# Altium schematic sheet CPLD.SchDoc
size A4
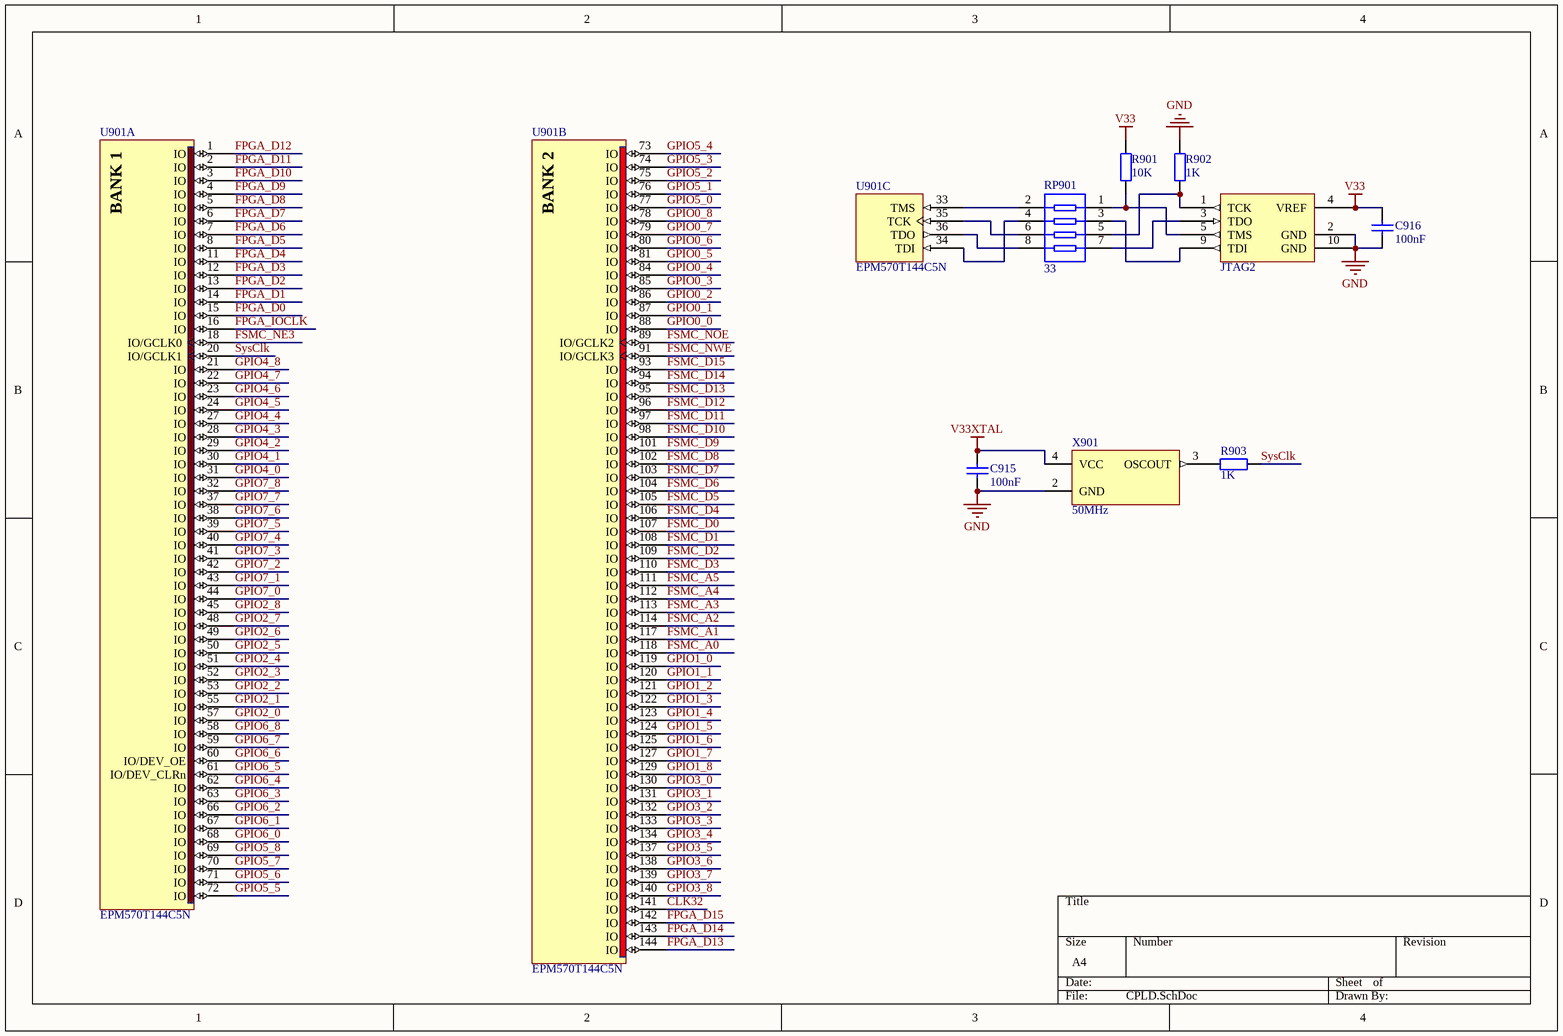
[diagram p0: CPLD.SchDoc]

## Parts
C915  value 100nF  [0603C]  (hidden comment: MLCC)
C916  value 100nF  [0805C]  (hidden comment: MLCC)
JTAG2  JTAG_ALTERA  [JTAG10]  (value not drawn)
R901  value 10K  [0603R]  (hidden comment: Resistor)
R902  value 1K  [0603R]  (hidden comment: Resistor)
R903  value 1K  [0603R]  (hidden comment: Resistor)
RP901  value 33  [8P4R_0603]  (hidden comment: Res Pack)
U901  EPM570T144C5N  [TQFP144_N]  (parts A,B,C of 5)
X901  value 50MHz  [XTAL-7050]  (hidden comment: Oscillator)

## Nets
GND: C915.1 C916.1 JTAG2.2(GND) JTAG2.10(GND) R902.2 X901.2(GND)
V33: C916.2 JTAG2.4(VREF) R901.2
V33XTAL: C915.2 X901.4(VCC)
CLK32: U901.141(IO)
FPGA_D0: U901.15(IO)
FPGA_D1: U901.14(IO)
FPGA_D2: U901.13(IO)
FPGA_D3: U901.12(IO)
FPGA_D4: U901.11(IO)
FPGA_D5: U901.8(IO)
FPGA_D6: U901.7(IO)
FPGA_D7: U901.6(IO)
FPGA_D8: U901.5(IO)
FPGA_D9: U901.4(IO)
FPGA_D10: U901.3(IO)
FPGA_D11: U901.2(IO)
FPGA_D12: U901.1(IO)
FPGA_D13: U901.144(IO)
FPGA_D14: U901.143(IO)
FPGA_D15: U901.142(IO)
FPGA_IOCLK: U901.16(IO)
FSMC_A0: U901.118(IO)
FSMC_A1: U901.117(IO)
FSMC_A2: U901.114(IO)
FSMC_A3: U901.113(IO)
FSMC_A4: U901.112(IO)
FSMC_A5: U901.111(IO)
FSMC_D0: U901.107(IO)
FSMC_D1: U901.108(IO)
FSMC_D2: U901.109(IO)
FSMC_D3: U901.110(IO)
FSMC_D4: U901.106(IO)
FSMC_D5: U901.105(IO)
FSMC_D6: U901.104(IO)
FSMC_D7: U901.103(IO)
FSMC_D8: U901.102(IO)
FSMC_D9: U901.101(IO)
FSMC_D10: U901.98(IO)
FSMC_D11: U901.97(IO)
FSMC_D12: U901.96(IO)
FSMC_D13: U901.95(IO)
FSMC_D14: U901.94(IO)
FSMC_D15: U901.93(IO)
FSMC_NE3: U901.18(IO/GCLK0)
FSMC_NOE: U901.89(IO/GCLK2)
FSMC_NWE: U901.91(IO/GCLK3)
GPIO0_0: U901.88(IO)
GPIO0_1: U901.87(IO)
GPIO0_2: U901.86(IO)
GPIO0_3: U901.85(IO)
GPIO0_4: U901.84(IO)
GPIO0_5: U901.81(IO)
GPIO0_6: U901.80(IO)
GPIO0_7: U901.79(IO)
GPIO0_8: U901.78(IO)
GPIO1_0: U901.119(IO)
GPIO1_1: U901.120(IO)
GPIO1_2: U901.121(IO)
GPIO1_3: U901.122(IO)
GPIO1_4: U901.123(IO)
GPIO1_5: U901.124(IO)
GPIO1_6: U901.125(IO)
GPIO1_7: U901.127(IO)
GPIO1_8: U901.129(IO)
GPIO2_0: U901.57(IO)
GPIO2_1: U901.55(IO)
GPIO2_2: U901.53(IO)
GPIO2_3: U901.52(IO)
GPIO2_4: U901.51(IO)
GPIO2_5: U901.50(IO)
GPIO2_6: U901.49(IO)
GPIO2_7: U901.48(IO)
GPIO2_8: U901.45(IO)
GPIO3_0: U901.130(IO)
GPIO3_1: U901.131(IO)
GPIO3_2: U901.132(IO)
GPIO3_3: U901.133(IO)
GPIO3_4: U901.134(IO)
GPIO3_5: U901.137(IO)
GPIO3_6: U901.138(IO)
GPIO3_7: U901.139(IO)
GPIO3_8: U901.140(IO)
GPIO4_0: U901.31(IO)
GPIO4_1: U901.30(IO)
GPIO4_2: U901.29(IO)
GPIO4_3: U901.28(IO)
GPIO4_4: U901.27(IO)
GPIO4_5: U901.24(IO)
GPIO4_6: U901.23(IO)
GPIO4_7: U901.22(IO)
GPIO4_8: U901.21(IO)
GPIO5_0: U901.77(IO)
GPIO5_1: U901.76(IO)
GPIO5_2: U901.75(IO)
GPIO5_3: U901.74(IO)
GPIO5_4: U901.73(IO)
GPIO5_5: U901.72(IO)
GPIO5_6: U901.71(IO)
GPIO5_7: U901.70(IO)
GPIO5_8: U901.69(IO)
GPIO6_0: U901.68(IO)
GPIO6_1: U901.67(IO)
GPIO6_2: U901.66(IO)
GPIO6_3: U901.63(IO)
GPIO6_4: U901.62(IO)
GPIO6_5: U901.61(IO/DEV_CLRn)
GPIO6_6: U901.60(IO/DEV_OE)
GPIO6_7: U901.59(IO)
GPIO6_8: U901.58(IO)
GPIO7_0: U901.44(IO)
GPIO7_1: U901.43(IO)
GPIO7_2: U901.42(IO)
GPIO7_3: U901.41(IO)
GPIO7_4: U901.40(IO)
GPIO7_5: U901.39(IO)
GPIO7_6: U901.38(IO)
GPIO7_7: U901.37(IO)
GPIO7_8: U901.32(IO)
SysClk: R903.2 U901.20(IO/GCLK1)
NetJTAG2_1: JTAG2.1(TCK) R902.1 RP901.5
NetJTAG2_3: JTAG2.3(TDO) RP901.7
NetJTAG2_5: JTAG2.5(TMS) R901.1 RP901.1
NetJTAG2_9: JTAG2.9(TDI) RP901.3
NetR903_1: R903.1 X901.3(OSCOUT)
NetRP901_2: RP901.2 U901.33(TMS)
NetRP901_4: RP901.4 U901.34(TDI)
NetRP901_6: RP901.6 U901.35(TCK)
NetRP901_8: RP901.8 U901.36(TDO)

## Notes on the sheet
- (in symbol EPM570T144C5N, part A) BANK 1
- (in symbol EPM570T144C5N, part B) BANK 2

## Library data of the parts
JTAG2 = JTAG_ALTERA: ALTERA JTAG port
RP901 = Res Pack: Isolated Resistor Network
U901 = EPM570T144C5N: MAX II 3.3/2.5V CPLD, 116 IOs, 570 Logic Elements, 144-Pin Plastic TQFP, Commercial Temperature, Speed Grade 5, Pb-Free; Note: Each set of VCCIO pins can be connected to 3.3V, 2.5V, 1.8V, or 1.5V.; Note: All VCCINT pins must be connected to either 3.3V or 2.5V (but not a combination of both).; DatasheetVersion: ver1.8, Jul-2006; PackageVersion: ver16.3, Dec-2010; PackageReference: TQFP144; PackageDescription: 144-Pin Plastic Thin Quad Flat Pack (TQFP144) - Wire Bond; Code_JEDEC: MS-026-BFB; ComponentLink1Description: Manufacturer URL; ComponentLink1URL: http://www.altera.com/; ComponentLink2Description: Handbook; ComponentLink2URL: http://www.altera.com/literature/hb/max2/max2_mii5v1.pdf; ComponentLink3Description: Package Specification; ComponentLink3URL: http://www.altera.com/literature/ds/dspkg.pdf
X901 = Oscillator_50MHz